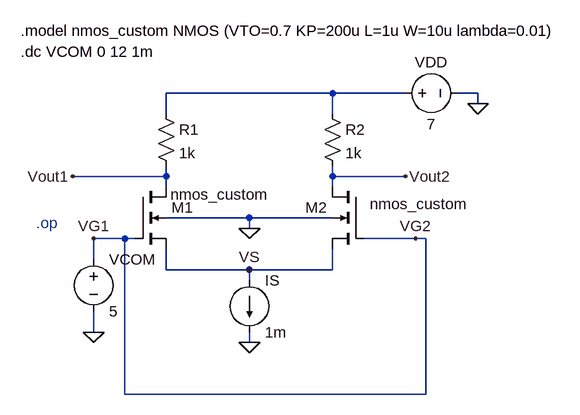
[diagram p0: schematic diffamp_common.asc]
diffamp_common.asc, the LTspice schematic file:
Version 4.1
SHEET 1 880 680
WIRE 416 -32 160 -32
WIRE 528 -32 416 -32
WIRE 640 -32 608 -32
WIRE 640 -16 640 -32
WIRE 160 0 160 -32
WIRE 416 0 416 -32
WIRE 160 96 160 80
WIRE 160 96 16 96
WIRE 416 96 416 80
WIRE 528 96 416 96
WIRE 160 112 160 96
WIRE 416 112 416 96
WIRE 288 160 160 160
WIRE 416 160 288 160
WIRE 288 176 288 160
WIRE 96 192 48 192
WIRE 112 192 96 192
WIRE 544 192 464 192
WIRE 560 192 544 192
WIRE 48 224 48 192
WIRE 160 240 160 208
WIRE 288 240 160 240
WIRE 416 240 416 208
WIRE 416 240 288 240
WIRE 288 256 288 240
WIRE 48 336 48 304
WIRE 288 352 288 336
WIRE 96 432 96 192
WIRE 560 432 560 192
WIRE 560 432 96 432
FLAG 288 352 0
FLAG 16 96 Vout1
FLAG 528 96 Vout2
FLAG 288 240 VS
FLAG 640 -16 0
FLAG 48 192 VG1
FLAG 544 192 VG2
FLAG 48 336 0
FLAG 288 176 0
SYMBOL current 288 256 R0
WINDOW 123 0 0 Left 0
WINDOW 39 0 0 Left 0
SYMATTR InstName IS
SYMATTR Value 1m
SYMBOL voltage 48 208 R0
WINDOW 123 0 0 Left 0
WINDOW 39 0 0 Left 0
SYMATTR InstName VCOM
SYMATTR Value 5
SYMBOL res 144 -16 R0
SYMATTR InstName R1
SYMATTR Value 1k
SYMBOL res 400 -16 R0
SYMATTR InstName R2
SYMATTR Value 1k
SYMBOL voltage 512 -32 R270
WINDOW 0 32 56 VTop 2
WINDOW 3 -32 56 VBottom 2
WINDOW 123 0 0 Left 0
WINDOW 39 0 0 Left 0
SYMATTR InstName VDD
SYMATTR Value 7
SYMBOL nmos4 112 112 R0
WINDOW 3 55 12 Left 2
SYMATTR InstName M1
SYMATTR Value nmos_custom
SYMBOL nmos4 464 112 M0
WINDOW 3 -160 27 Left 2
SYMATTR Value nmos_custom
SYMATTR InstName M2
TEXT -40 168 Left 2 ;.op
TEXT -64 -128 Left 2 !.model nmos_custom NMOS (VTO=0.7 KP=200u L=1u W=10u lambda=0.01)
TEXT -64 -96 Left 2 !.dc VCOM 0 12 1m

The netlist it stands for:
* diffamp_common.asc
IS VS 0 1m
VCOM VG2 0 5
R1 N001 Vout1 1k
R2 N001 Vout2 1k
VDD N001 0 7
M1 Vout1 VG2 VS 0 nmos_custom
M2 Vout2 VG2 VS 0 nmos_custom
.model NMOS NMOS
.model PMOS PMOS
.lib standard.mos
* .op
.model nmos_custom NMOS (VTO=0.7 KP=200u L=1u W=10u lambda=0.01)
.dc VCOM 0 12 1m
.backanno
.end

* Results of the author's LTspice run, read from the files saved beside the schematic
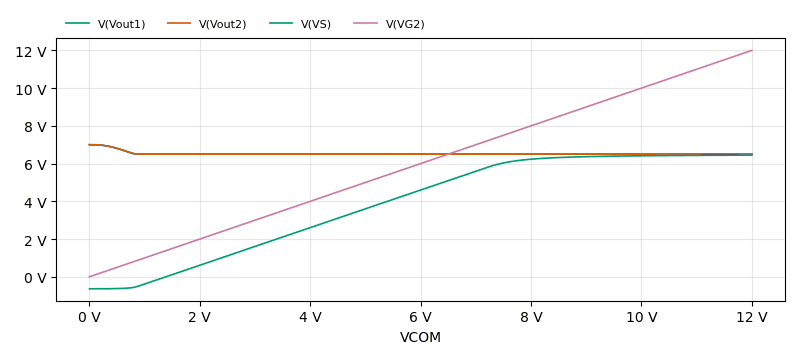
[diagram p1: DC transfer characteristic of diffamp_common.asc, plotted from the saved traces]
* DC transfer characteristic, 1 run:
*   V(Vout1): 7 V at VCOM=0 V, 6.5 V at VCOM=12 V, min 6.5 V, max 7 V
*   V(Vout2): 7 V at VCOM=0 V, 6.5 V at VCOM=12 V, min 6.5 V, max 7 V
*   V(VS): -637.2 mV at VCOM=0 V, 6.448 V at VCOM=12 V, min -637.2 mV, max 6.448 V
*   V(VG2): 0 V at VCOM=0 V, 12 V at VCOM=12 V, min 0 V, max 12 V